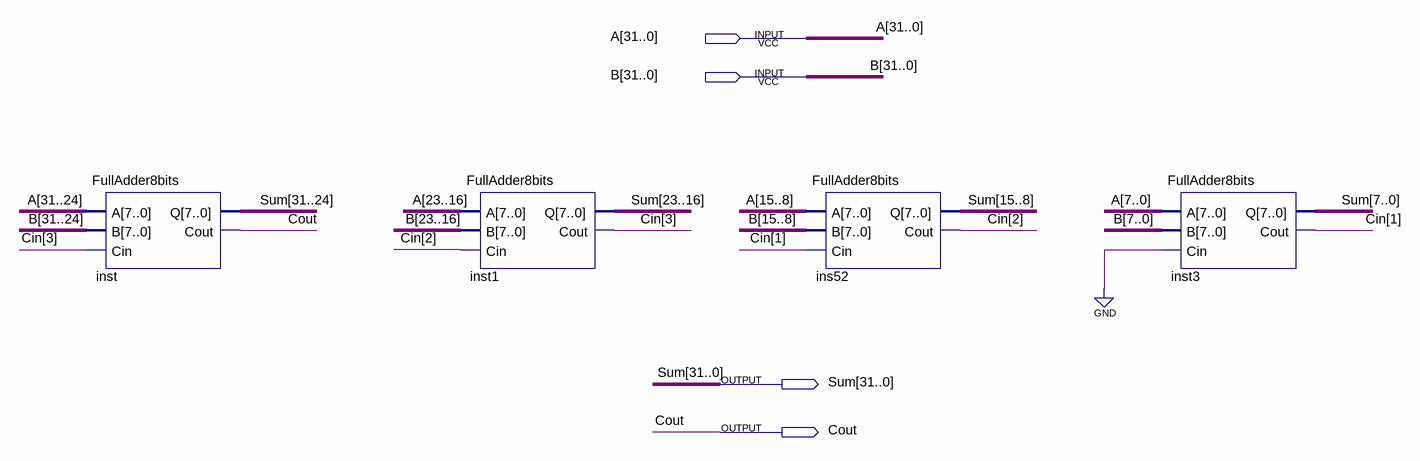
[diagram p0: schematic sheet]
// Quartus schematic FullAdder32bits.bdf as structural Verilog: 4 symbols, 4 pins
module FullAdder32bits (
  input  [31:0] A,
  input  [31:0] B,
  output [31:0] Sum,
  output Cout
);

  wire [3:1] Cin;

  FullAdder8bits inst (.A(A[31:24]), .B(B[31:24]), .Cin(Cin[3]), .Q(Sum[31:24]), .Cout(Cout));
  FullAdder8bits inst1 (.A(A[23:16]), .B(B[23:16]), .Cin(Cin[2]), .Q(Sum[23:16]), .Cout(Cin[3]));
  FullAdder8bits ins52 (.A(A[15:8]), .B(B[15:8]), .Cin(Cin[1]), .Q(Sum[15:8]), .Cout(Cin[2]));
  FullAdder8bits inst3 (.A(A[7:0]), .B(B[7:0]), .Cin(1'b0), .Q(Sum[7:0]), .Cout(Cin[1]));
endmodule
